# EAGLE design programming-adapter-2edge (EAGLE 7.3.0)
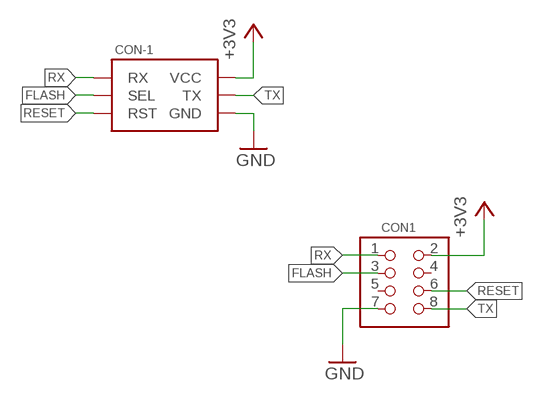
[diagram p0: schematic, sheet 1]

## Parts
CON1  GENERIC-2X4-EDGE  [PINHEADER-2X4-EDGE]
CON-1  ESP8266-6_PIN-EDGE  [EDGE-6_PIN]

## Nets
+3V3: CON1.2 CON-1.2(VCC)
FLASH: CON1.3 CON-1.3(SEL)
GND: CON1.7 CON-1.6(GND)
RESET: CON1.6 CON-1.5(RST)
RX: CON1.1 CON-1.1(RX)
TX: CON1.8 CON-1.4(TX)
Unconnected: CON1.4 CON1.5

## Library data of the parts
CON1 = p.peter-connectors:GENERIC-2X4
CON-1 = p.peter-connectors:ESP8266-6_PIN

## Board
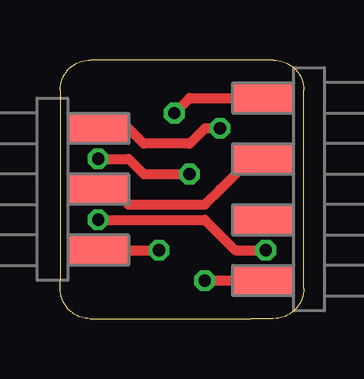
[diagram p1: board, top side]
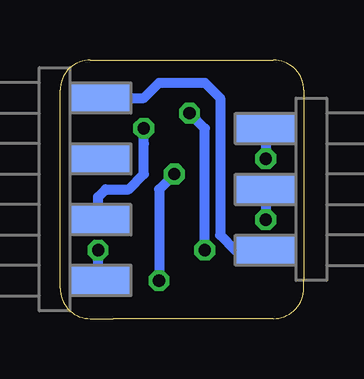
[diagram p2: board, bottom side, seen from below]

Size 10.16 x 10.79 mm. Coordinates in mm from the lower left corner, seen from the top.
Outline: 1.27,0 7.94,0 8.89,0 arc90 10.16,1.27 10.16,9.52 arc90 8.89,10.8 1.27,10.8 arc90 0,9.52 0,1.59 0,1.27 arc90 1.27,0
Copper layers (1*16): Top 0.0356mm / dielectric 1.5011mm / Bottom 0.0356mm
Design rules "oshpark": minimum track width 6mil, minimum drill 13mil, track to track 6mil, track to pad 6mil, pad to pad 6mil, via to via 6mil, smd to smd 6mil, copper to edge 15mil, drill to drill 6mil, minimum pad ring 7mil, minimum via ring 7mil, stop-mask expansion 4mil, vias tented up to drill 4.1mm, thermal gap 10mil

### Footprints (pad centres in the part's own frame; a part is rotated, then mirrored left to right if it is on the bottom)
PINHEADER-2X4-EDGE = smd 1.27 x 2.54: 1 3.81,2; 3 1.27,2; 5 -1.27,2; 7 -3.81,2 | smd 1.27 x 2.54 bottom: 2 3.81,2; 4 1.27,2; 6 -1.27,2; 8 -3.81,2
EDGE-6_PIN = smd 1.27 x 2.54: 1 2.54,0; 3 0,0; 5 -2.54,0 | smd 1.27 x 2.54 bottom: 2 2.54,0; 4 0,0; 6 -2.54,0

### Placement (x,y rotation side)
CON1  10.48,5.4 90 top
CON-1  1.59,5.4 270 top

### Tracks (layer width: path | path; a pad name or v marks a point on that pad's centre or on a via)
+3V3
  Bottom 0.406: CON1.2 6.67,9.21 6.03,9.84 4.13,9.84 3.49,9.21 3.49,3.49 2.86,2.86 CON-1.2
FLASH
  Top 0.406: CON-1.3 2.22,5.4 2.86,4.76 6.03,4.76 6.67,5.4 7.94,6.67 CON1.3
GND  (via drill 0.51 pad 0.51)
  Top 0.406: v1.59,6.67 2.86,6.67 3.49,6.03 v5.4,6.03 | v6.03,1.59 CON1.7
  Bottom 0.406: CON-1.6 v1.59,6.67 | v5.4,6.03 6.03,5.4 v6.03,1.59
RESET  (via drill 0.51 pad 0.51)
  Top 0.406: v6.67,7.94 6.03,7.94 5.4,7.3 3.49,7.3 2.86,7.94 CON-1.5
  Bottom 0.406: CON1.6 8.57,4.13 8.57,5.08 8.26,5.4 7.3,5.4 6.67,6.03 6.67,7.3 v6.67,7.94
RX  (via drill 0.51 pad 0.51)
  Top 0.406: CON-1.1 v4.13,2.86 | v4.76,8.57 5.4,9.21 CON1.1
  Bottom 0.406: v4.13,2.86 4.13,7.94 v4.76,8.57
TX  (via drill 0.51 pad 0.51)
  Top 0.406: v1.59,4.13 6.03,4.13 7.3,2.86 v8.57,2.86
  Bottom 0.406: CON-1.4 1.59,4.76 v1.59,4.13 | CON1.8 8.57,1.59 v8.57,2.86